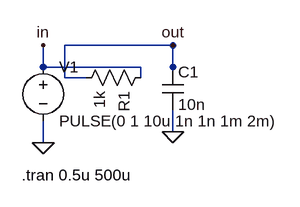
[diagram p0: schematic step.asc]
step.asc, the LTspice schematic file:
Version 4
SHEET 1 880 680
WIRE 128 80 272 80
WIRE 272 80 272 96
WIRE 192 96 160 96
WIRE 160 96 160 48
WIRE 160 48 320 48
WIRE 320 48 320 80
WIRE 128 80 128 48
WIRE 320 80 320 48
WIRE 128 160 128 192
WIRE 320 144 320 176
FLAG 128 48 in
FLAG 320 48 out
FLAG 128 192 0
FLAG 320 176 0
SYMBOL voltage 128 64 R0
SYMATTR InstName V1
SYMATTR Value PULSE(0 1 10u 1n 1n 1m 2m)
SYMBOL res 288 80 R90
SYMATTR InstName R1
SYMATTR Value 1k
SYMBOL cap 304 80 R0
SYMATTR InstName C1
SYMATTR Value 10n
TEXT 96 240 Left 2 !.tran 0.5u 500u

The netlist it stands for:
* step.asc
V1 in 0 PULSE(0 1 10u 1n 1n 1m 2m)
R1 in out 1k
C1 out 0 10n
.tran 0.5u 500u
.backanno
.end